# Altium schematic sheet [03] - CORE MCU.SchDoc: DWM1003
size A4; DocumentNumber: 3; Revision: v2; SheetNumber: 3; SheetTotal: 7; SheetFunction: nRF MCU
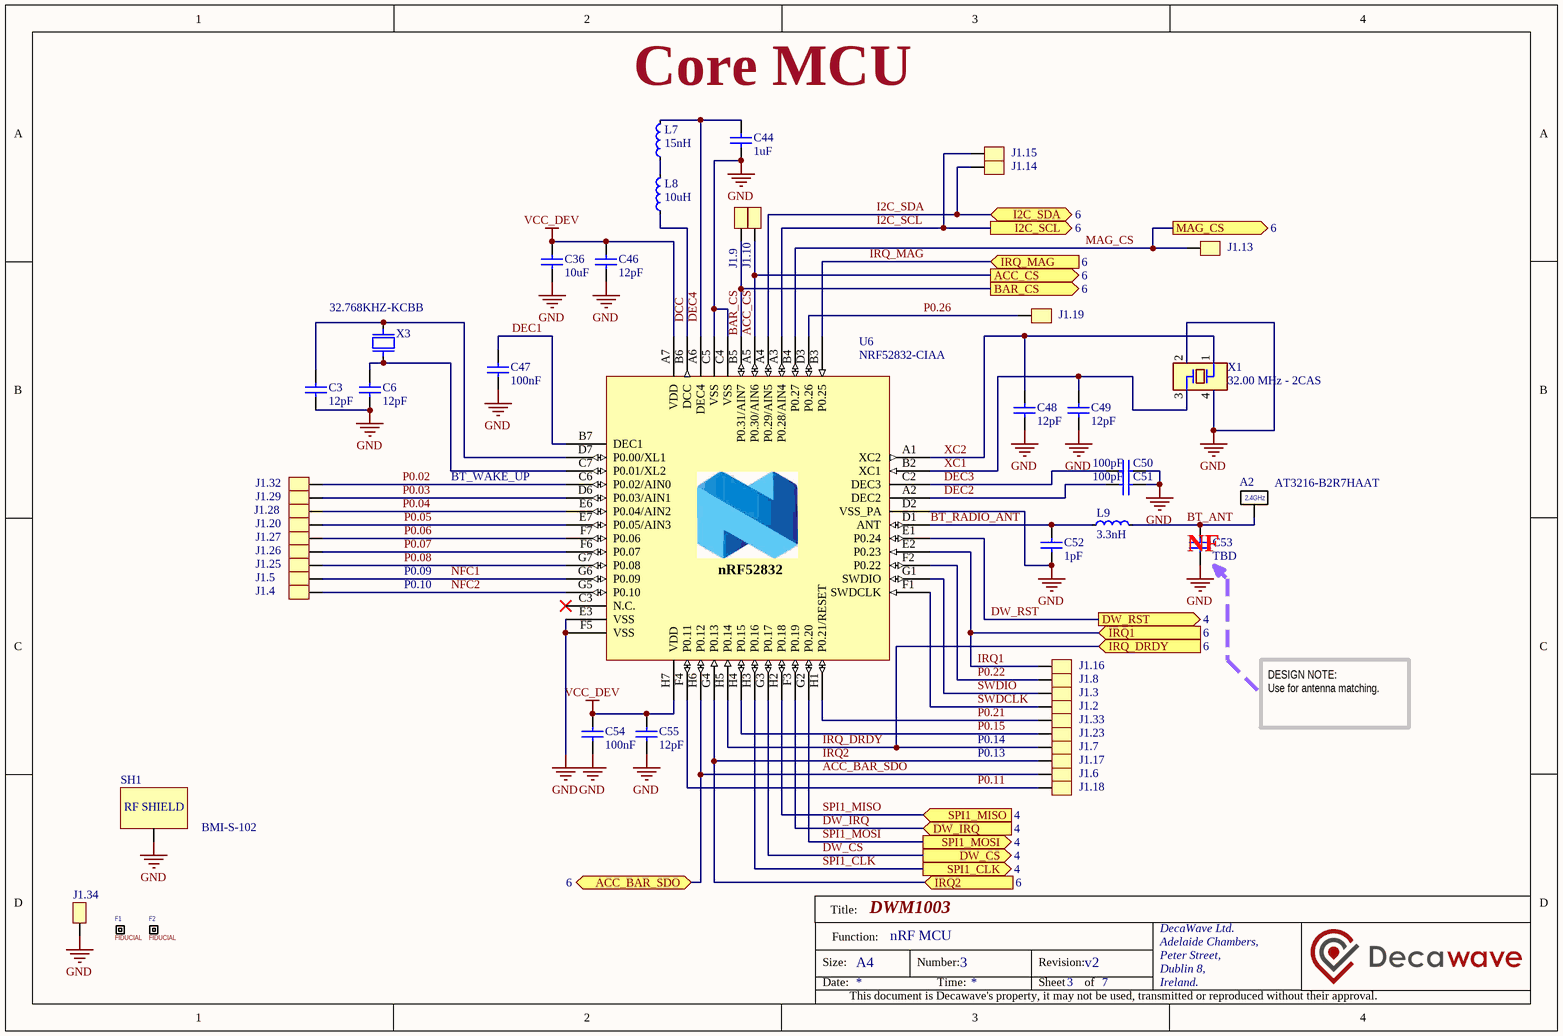
[diagram p0: [03] - CORE MCU.SchDoc]

## Parts
A2  AT3216-B2R7HAAT  [AT3216]
C3  12pF  [C0201]
C6  12pF  [C0201]
C36  10uF  [C0603]
C44  1uF  [C0402]
C46  12pF  [C0201]
C47  100nF  [C0201]
C48  12pF  [C0201]
C49  12pF  [C0201]
C50  100pF  [C0201]
C51  100pF  [C0201]
C52  1pF  [C0201]
C53  TBD  [C0201]
C54  100nF  [C0201]
C55  12pF  [C0201]
F1  FIDUCIAL  [FID1]
F2  FIDUCIAL  [FID1]
J1.2  EDGE_PIN  [PCB_EDGE_1MM]  (value not drawn)
J1.3  EDGE_PIN  [PCB_EDGE_1MM]  (value not drawn)
J1.4  EDGE_PIN  [PCB_EDGE_1MM]  (value not drawn)
J1.5  EDGE_PIN  [PCB_EDGE_1MM]  (value not drawn)
J1.6  EDGE_PIN  [PCB_EDGE_1MM]  (value not drawn)
J1.7  EDGE_PIN  [PCB_EDGE_1MM]  (value not drawn)
J1.8  EDGE_PIN  [PCB_EDGE_1MM]  (value not drawn)
J1.9  EDGE_PIN  [PCB_EDGE_1MM]  (value not drawn)
J1.10  EDGE_PIN  [PCB_EDGE_1MM]  (value not drawn)
J1.13  EDGE_PIN  [PCB_EDGE_1MM]  (value not drawn)
J1.14  EDGE_PIN  [PCB_EDGE_1MM]  (value not drawn)
J1.15  EDGE_PIN  [PCB_EDGE_1MM]  (value not drawn)
J1.16  EDGE_PIN  [PCB_EDGE_1MM]  (value not drawn)
J1.17  EDGE_PIN  [PCB_EDGE_1MM]  (value not drawn)
J1.18  EDGE_PIN  [PCB_EDGE_1MM]  (value not drawn)  (no BOM)
J1.19  EDGE_PIN  [PCB_EDGE_1MM]  (value not drawn)  (no BOM)
J1.20  EDGE_PIN  [PCB_EDGE_1MM]  (value not drawn)  (no BOM)
J1.23  EDGE_PIN  [PCB_EDGE_1MM]  (value not drawn)
J1.25  EDGE_PIN  [PCB_EDGE_1MM]  (value not drawn)
J1.26  EDGE_PIN  [PCB_EDGE_1MM]  (value not drawn)
J1.27  EDGE_PIN  [PCB_EDGE_1MM]  (value not drawn)
J1.28  EDGE_PIN  [PCB_EDGE_1MM]  (value not drawn)
J1.29  EDGE_PIN  [PCB_EDGE_1MM]  (value not drawn)
J1.32  EDGE_PIN  [PCB_EDGE_1MM]  (value not drawn)
J1.33  EDGE_PIN  [PCB_EDGE_1MM]  (value not drawn)
J1.34  EDGE_PIN  [PCB_EDGE_1MM]  (value not drawn)
L7  15nH  [INDC1005X05N]
L8  10uH  [L0603]
L9  3.3nH  [L0201]
SH1  BMI-S-102  [BMI-S102]
U6  NRF52832-CIAA  [BGA50C40P7X8_295X322X50]
X1  32.00 MHz - 2CAS  [ABM10]
X3  32.768KHZ-KCBB  [XTAL_SMD_3.2X1.5MM]

## Ports
ACC_BAR_SDO (bidir, see 6), ACC_CS (out, see 6), BAR_CS (out, see 6), DW_CS (out, see 4), DW_IRQ (in, see 4), DW_RST (out, see 4), I2C_SCL (out, see 6), I2C_SDA (bidir, see 6), IRQ1 (in, see 6), IRQ2 (in, see 6), IRQ_DRDY (in, see 6), IRQ_MAG (in, see 6), MAG_CS (out, see 6), SPI1_CLK (out, see 4), SPI1_MISO (in, see 4), SPI1_MOSI (out, see 4)

## Nets
GND: C3.1 C6.1 C36.1 C44.1 C46.1 C47.1 C48.1 C49.1 C50.1 C51.1 C52.1 C53.1 C54.1 C55.1 J1.34.0 SH1.0(GND) U6.C4(VSS) U6.C5(VSS) U6.D2(VSS_PA) U6.E3(VSS) U6.F5(VSS) X1.2 X1.4
VCC_DEV: C36.2 C46.2 C54.2 C55.2 U6.A7(VDD) U6.H7(VDD)
ACC_BAR_SDO: J1.6.0 U6.H6(P0.12) ; port ACC_BAR_SDO
ACC_CS: J1.10.0 U6.A5(P0.30/AIN6) ; port ACC_CS
BAR_CS: J1.9.0 U6.B5(P0.31/AIN7) ; port BAR_CS
BT_ANT: A2.1 C53.2 L9.2
BT_RADIO_ANT: C52.2 L9.1 U6.D1(ANT)
DCC: L8.1 U6.B6(DCC)
DEC1: C47.2 U6.B7(DEC1)
DEC2: C51.2 U6.A2(DEC2)
DEC3: C50.2 U6.C2(DEC3)
DEC4: C44.2 L7.2 U6.A6(DEC4)
DW_CS: U6.G3(P0.17) ; port DW_CS
DW_IRQ: U6.F3(P0.19) ; port DW_IRQ
DW_RST: U6.E1(P0.24) ; port DW_RST
I2C_SCL: J1.15.0 U6.A3(P0.28/AIN4) ; port I2C_SCL
I2C_SDA: J1.14.0 U6.A4(P0.29/AIN5) ; port I2C_SDA
IRQ1: J1.16.0 U6.E2(P0.23) ; port IRQ1
IRQ2: J1.17.0 U6.G4(P0.13) ; port IRQ2
IRQ_DRDY: J1.7.0 U6.H5(P0.14) ; port IRQ_DRDY
IRQ_MAG: U6.B3(P0.25) ; port IRQ_MAG
MAG_CS: J1.13.0 U6.B4(P0.27) ; port MAG_CS
NFC1: J1.5.0 U6.G6(P0.09)
NFC2: J1.4.0 U6.G5(P0.10)
P0.02: J1.32.0 U6.C6(P0.02/AIN0)
P0.03: J1.29.0 U6.D6(P0.03/AIN1)
P0.04: J1.28.0 U6.E6(P0.04/AIN2)
P0.05: J1.20.0 U6.E7(P0.05/AIN3)
P0.06: J1.27.0 U6.F7(P0.06)
P0.07: J1.26.0 U6.F6(P0.07)
P0.08: J1.25.0 U6.G7(P0.08)
P0.11: J1.18.0 U6.F4(P0.11)
P0.15: J1.23.0 U6.H4(P0.15)
P0.21: J1.33.0 U6.H1(P0.21/RESET)
P0.22: J1.8.0 U6.F2(P0.22)
P0.26: J1.19.0 U6.D3(P0.26)
SPI1_CLK: U6.H3(P0.16) ; port SPI1_CLK
SPI1_MISO: U6.H2(P0.18) ; port SPI1_MISO
SPI1_MOSI: U6.G2(P0.20) ; port SPI1_MOSI
SWDCLK: J1.2.0 U6.F1(SWDCLK)
SWDIO: J1.3.0 U6.G1(SWDIO)
XC1: C49.2 U6.B2(XC1) X1.3
XC2: C48.2 U6.A1(XC2) X1.1
NetC3_2: C3.2 U6.D7(P0.00/XL1) X3.2
NetC6_2: C6.2 U6.C7(P0.01/XL2) X3.1
NetL7_1: L7.1 L8.2

Not connected (* = marked no-connect by the designer): U6 C3(N.C.)*

## Notes on the sheet
- Core MCU
- BT_WAKE_UP
- P0.09
- (near C53) NF
- P0.10
- DESIGN NOTE:
  Use for antenna matching.
- P0.14
- P0.13
- Title:
- Size:
- Date:
- Function:
- A4
- Number:
- Time:
- Revision:
- Sheet
- of
- DecaWave Ltd.
- Adelaide Chambers,
- Peter Street,
- Dublin 8,
- Ireland.
- This document is Decawave's property, it may not be used, transmitted or reproduced without their approval.
- (in symbol AT3216-B2R7HAAT) 2.4GHz
- (in symbol BMI-S-102) RF SHIELD
- (in symbol NRF52832-CIAA-R) nRF52832

## Library data of the parts
A2 = AT3216-B2R7HAAT: CHIP, 2.45GHZ, 50 OHM, 3.2x1.6 ACX - AAT3216-B2R7HAAT- ANTENNA; Manufacturer: ACX; Manufacturer Part Number: AT3216-B2R7HAAT
C3 C6 C46 C48 C49 C55 = GRM0335C1E120JA01D: CAP CER 12PF 25V NP0 0201; Manufacturer: Murata Electronics North America; Manufacturer Part Number: GRM0335C1E120JA01D
C36 = GRM188R60J106ME84D: CAP CER 10UF 6.3V X5R 0603; Manufacturer: Murata Electronics North America; Manufacturer Part Number: GRM188R60J106ME47D
C44 = GRM155R61A105KE15D: CAP CER 1UF 10V X5R 0402; Manufacturer: Murata Electronics North America; Manufacturer Part Number: GRM155R61A105KE15D
C47 C54 = GRM033C81E104ME14D: CAP CER 0.1UF 25V X6S 0201; Manufacturer: Murata Electronics North America; Manufacturer Part Number: GRM033C81E104ME14D
C50 C51 = GRM0335C1E101JA01D: CAP CER 100PF 25V NP0 0201; Manufacturer: Murata Electronics North America; Manufacturer Part Number: GRM0335C1E101JA01D
C52 C53 = GRM0335C1H1R0BA01D: CAP CER 1PF 50V NP0 0201; Manufacturer: Murata Electronics North America; Manufacturer Part Number: GRM0335C1H1R0BA01D
F1 F2 = FID1: Fiducial 1mm
J1.2-J1.10 J1.13-J1.20 J1.23 J1.25-J1.29 J1.32-J1.34 = EDGE_PIN: PCB Edge pin
L7 = HK100515NJ-T: FIXED IND 15NH 320MA 460 MOHM; Manufacturer: Taiyo Yuden; Manufacturer Part Number: HK100515NJ-T
L8 = LBMF1608T100K: FIXED IND 10UH 80MA 360 MOHM SMD; Manufacturer: Taiyo Yuden; Manufacturer Part Number: LBMF1608T100K
L9 = LQP03TG3N3C02D: FIXED IND 3.3NH 400MA 320 MOHM; Manufacturer: Murata Electronics North America; Manufacturer Part Number: LQP03TG3N3C02D
SH1 = BMI-S-102: BOARD SHIELD .65X.65" 1PIECE; Manufacturer: Laird Technologies EMI; Manufacturer Part Number: BMI-S-102
U6 = NRF52832-CIAA-R: IC RF TXRX+MCU BLUETOOTH 50WLCSP; Manufacturer: Nordic Semiconductor ASA; Manufacturer Part Number: NRF52832-CIAA-R; RF Family/Standard: *; Protocol: *; Modulation: *; Frequency: *; Data Rate (Max): *; Power - Output: *; Sensitivity: *; Memory Size: *; Serial Interfaces: *; GPIO: *; Voltage - Supply: *; Current - Receiving: *; Current - Transmitting: *; Operating Temperature: *
X1 = ABM10: Manufacturer: Commutek; Manufacturer Part Number: 2CAS
X3 = ABS06-32.768KHZ-T: CRYSTAL 32.7680KHZ 12.5PF SMD; Manufacturer: Commutek; Manufacturer Part Number: KCBB